# Altium project DMP_SEM_MAIN_BOARD_CONSTRAINT.PrjPcb
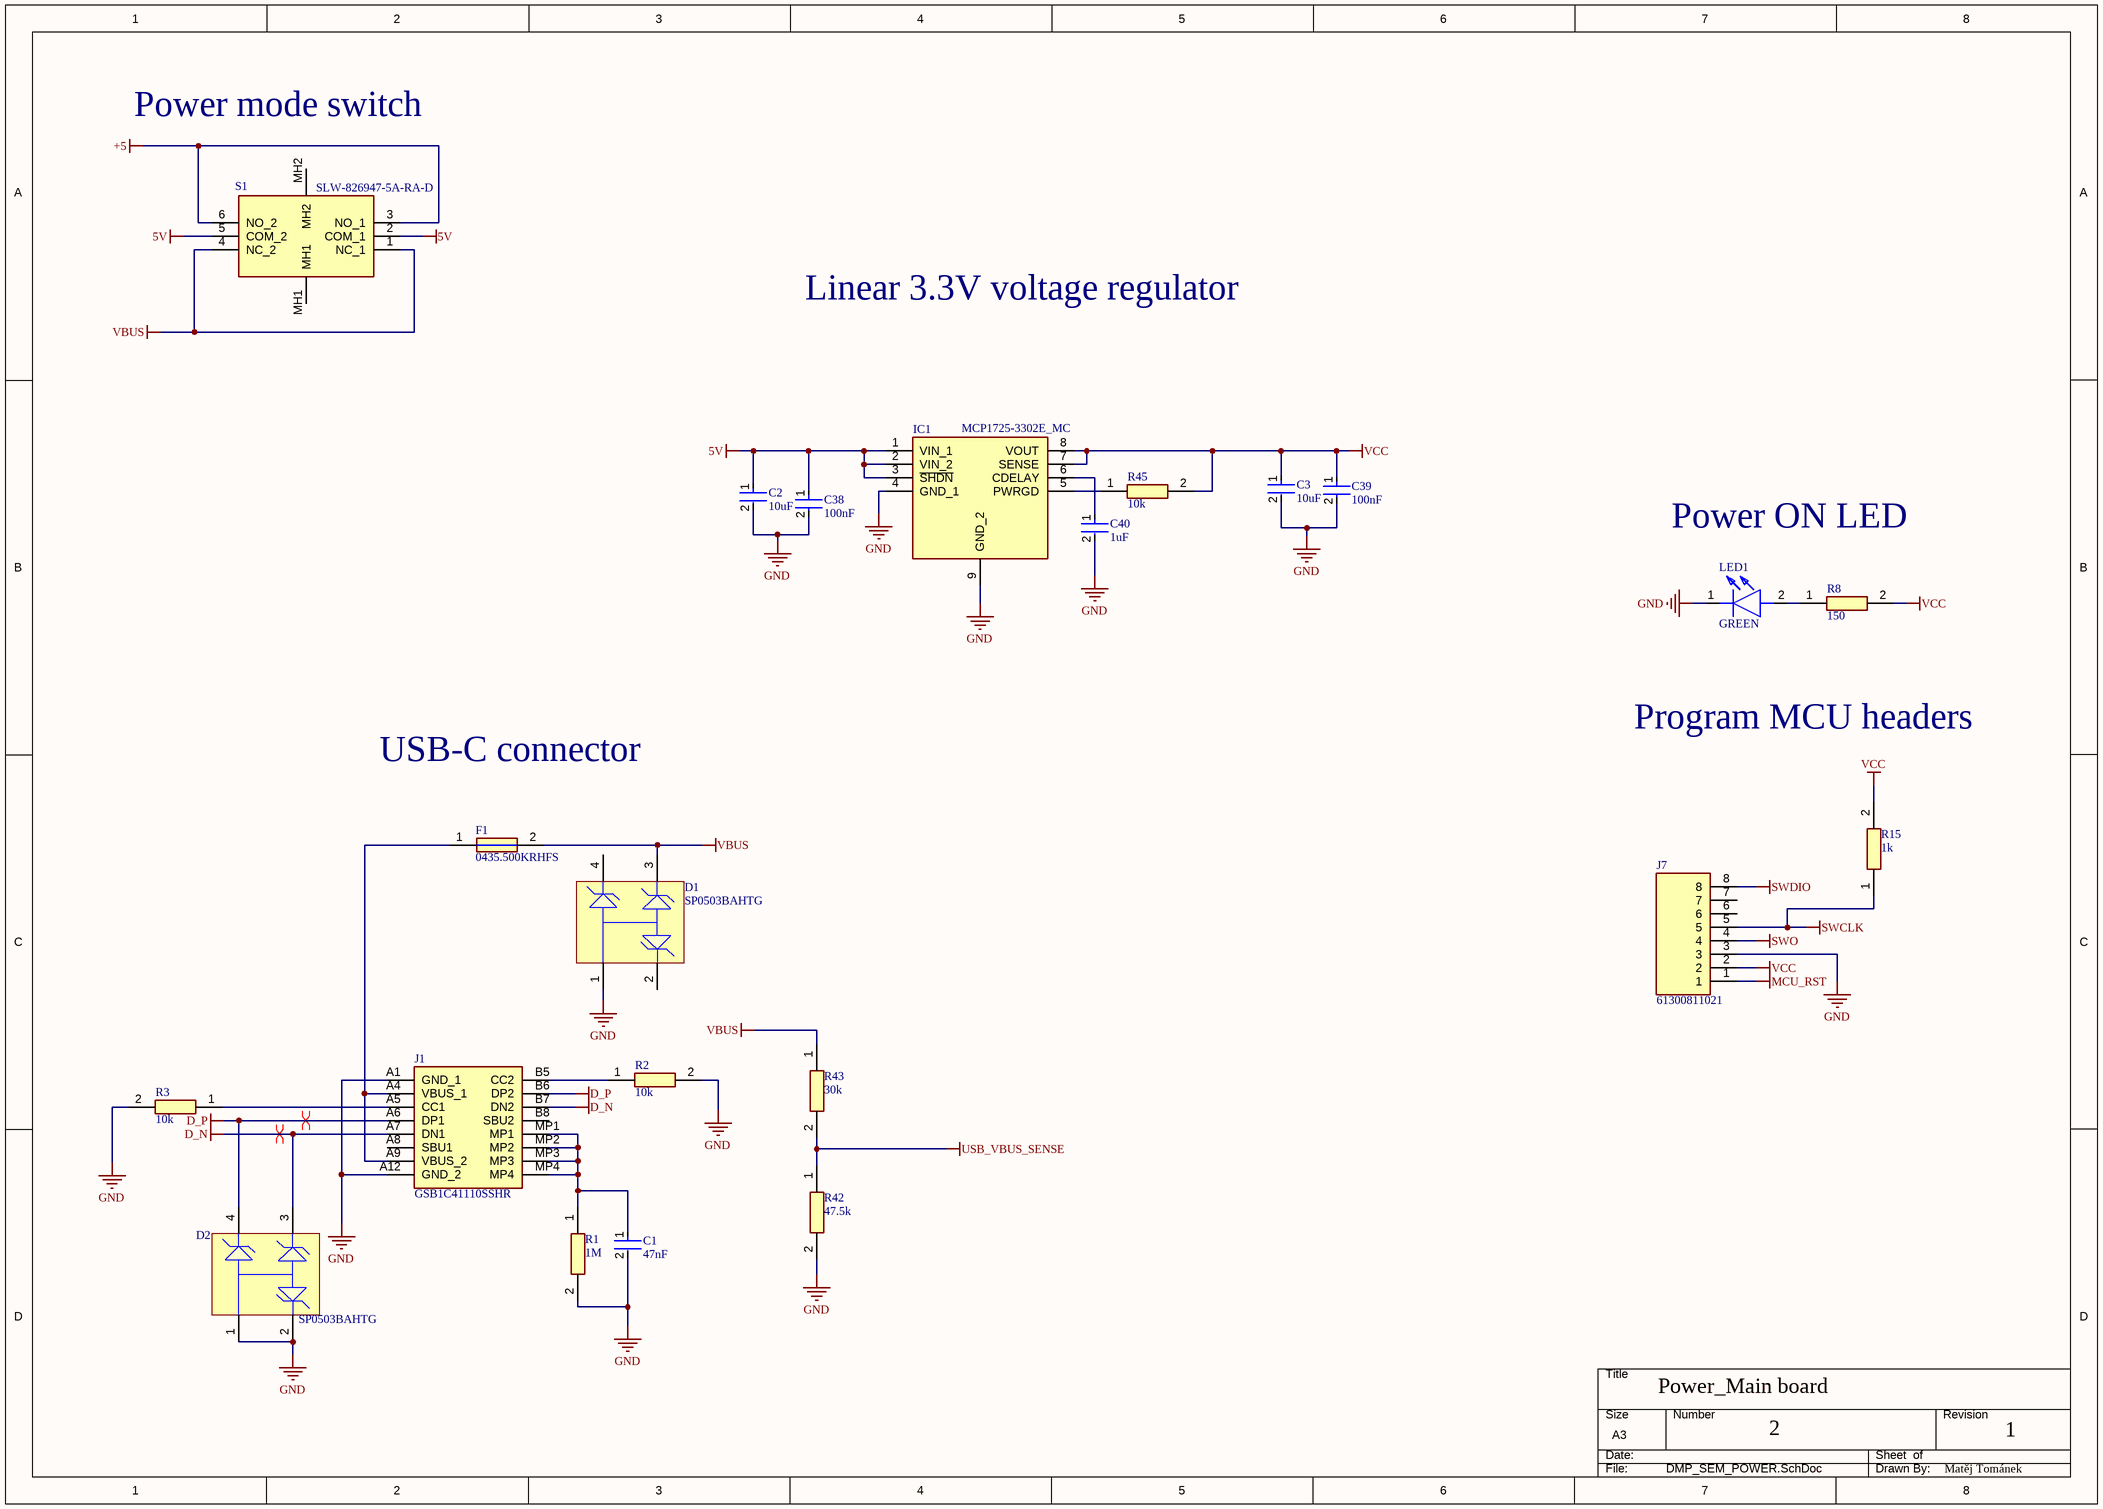
[diagram p0: DMP_SEM_POWER.SchDoc]
4 sheets, 97 parts. Net scope: global (net labels, ports and power ports of the same name join across sheets).
Board file: DMP_SEM_MAIN_PCB.PcbDoc
Sheets:
  DMP_SEM_POWER.SchDoc
  DMP_SEM_MCU.SchDoc
  DMP_SEM_ETHERNET.SchDoc
  DMP_SEM_SDCARD.SchDoc

## Sheet DMP_SEM_POWER.SchDoc: Target MCU
size A3; Organization: Microchip; Address1: Vestre Rosten 79; Address2: N-7075 TILLER; Address3: NORWAY; DocumentNumber: A09-2748; Revision: 11; SheetNumber: 1; SheetTotal: 4; DrawnBy: Microchip Norway; Engineer: HN; PageSetup: Record=PageOptions|CenterHorizontal=True|CenterVertical=True|PrintScale=1.01|XCorrection=1.00|YCorrection=1.00|PrintKind=1|BorderSize=5000000|LeftOffset=0|BottomOffset=0|Orientation=2|PaperLength=1000|PaperWidth=1000|Scale=100|PaperSource=7|PrintQuality=-4|MediaType=1|DitherType=10|PaperKind=A3 (297 x 420 mm)|PrintScaleMode=1; ProjectTitle: SAM E54 Xplained Pro; PCBNumber: A08-2643; PCBRevision: 4; ProjectName: SAM E54 Xplained Pro

### Parts
C1  47nF  [C0603X473J3RAC3316]
C2  10uF  [CL10A106KO8NQNC]
C3  10uF  [CL10A106KO8NQNC]
C38  100nF  [CL05B104KO5NNNC]
C39  100nF  [CL05B104KO5NNNC]
C40  1uF  [GRM155C81C105KE11D]
D1  SP0503BAHTG  [SP0503BAHTG]
D2  SP0503BAHTG  [SP0503BAHTG]
F1  0435.500KRHFS  [0435.500KRHFS]
IC1  MCP1725-3302E_MC  [MCP1725-3302E_MC]
J1  GSB1C41110SSHR  [GSB1C41110SSHR]
J7  61300811021  [61300811021]
LED1  GREEN  [SMLEN3EC8TT86]
R1  1M  [RC0402FR-071ML]
R2  10k  [CRCW060310K0FKEA]
R3  10k  [CRCW060310K0FKEA]
R8  150  [CRCW0402150RFKEDHP]
R15  1k  [RC0603FR-071KL]
R42  47.5k  [ERJ-PA3D4752V]
R43  30k  [RT0603DRD0730KL]
R45  10k  [CRCW060310K0FKEA]
S1  SLW-826947-5A-RA-D  [SLW-826947-5A-RA-D]

### Nets
5V: C2.1 C38.1 IC1.1(VIN_1) IC1.2(VIN_2) IC1.3(~{SHDN}) S1.2(COM_1) S1.5(COM_2)
+5: S1.3(NO_1) S1.6(NO_2)
D_N: D2.3 J1.A7(DN1) J1.B7(DN2)
D_P: D2.4 J1.A6(DP1) J1.B6(DP2)
GND: C1.2 C2.2 C3.2 C38.2 C39.2 C40.2 D1.1 D2.1 D2.2 IC1.4(GND_1) IC1.9(GND_2) J1.A1(GND_1) J1.A12(GND_2) J7.3 LED1.1(K) R1.2 R2.2 R3.2 R42.2
MCU_RST: J7.1
SWCLK: J7.5 R15.1
SWDIO: J7.8
SWO: J7.4
USB_VBUS_SENSE: R42.1 R43.2
VBUS: D1.3 F1.2 R43.1 S1.1(NC_1) S1.4(NC_2)
VCC: C3.1 C39.1 IC1.7(SENSE) IC1.8(VOUT) J7.2 R8.2 R15.2 R45.2
NetC1_1: C1.1 J1.MP1 J1.MP2 J1.MP3 J1.MP4 R1.1
NetC40_1: C40.1 IC1.6(CDELAY)
NetF1_1: F1.1 J1.A4(VBUS_1) J1.A9(VBUS_2)
NetIC1_5: IC1.5(PWRGD) R45.1
NetJ1_A5: J1.A5(CC1) R3.1
NetJ1_B5: J1.B5(CC2) R2.1
NetLED1_2: LED1.2(A) R8.1

Not connected (* = marked no-connect by the designer): D1 2 4; J1 A8(SBU1) B8(SBU2); J7 6 7; S1 MH1 MH2

### Layout directives
differential pair: D_N, D_P

### Notes on the sheet
- Power mode switch
- Linear 3.3V voltage regulator
- Power ON LED
- USB-C connector
- Program MCU headers
- Power_Main board
- 2
- 1
- Matěj Tománek
- DWG. NO.
- REV.
- SHT.
- THIS DOCUMENT AND THE DATA DISCLOSED HEREIN OR HEREWITH IS THE PROPERTY OF ALTIUM LIMITED AND MAY BE FREELY DISTRIBUTED IN WHOLE. NO RIGHTS ARE RESERVED OR EXPRESS OR IMPLIED WARANTEE GIVEN.
- REVISION
- DESCRIPTION
- DATE
- APPROVED
- ENG:
- APPROVALS
- PROJECT
- DSN:
- CHK:
- REFERENCE DOCUMENTS
- PROJECT REVISION:
- TITLE
- DOCUMENT REVISION:
- DESIGN ITEM:
- BOM:
- FAB DWG:
- PCB DWG:
- ASSY DWG:
- SCALE:
- SIZE
- B
- CAGE CODE
- FILE NAME
- DWG NO.
- SHEET
- OF
- REV

### Library data of the parts
C1 = C0603X473J3RAC3316: Capacitor C0603X473J3RAC3316
C2 C3 = CL10A106KO8NQNC: Capacitor CL10A106KO8NQNC
C38 C39 = CL05B104KO5NNNC: Capacitor CL05B104KO5NNNC
C40 = GRM155C81C105KE11D: Capacitor GRM155C81C105KE11D
D1 D2 = SP0503BAHTG: TVS Diodes SP0503BAHTG
F1 = 0435.500KRHFS: Fuse 0435.500KRHFS
IC1 = MCP1725-3302E_MC: Linear voltage regulator  MCP1725-3302E_MC
J1 = GSB1C41110SSHR: USB-C Connector
J7 = 61300811021: Programing connector 61300811021
LED1 = SMLEN3EC8TT86: GREEN LED Diode
R1 = RC0402FR-071ML: Resistor RC0402FR-071ML
R2 R3 R45 = CRCW060310K0FKEA: Resistor CRCW060310K0FKEA
R8 = CRCW0402150RFKEDHP: Resistor CRCW0402150RFKEDHP
R15 = RC0603FR-071KL: Resistor RC0603FR-071KL
R42 = ERJ-PA3D4752V: Resistor ERJ-PA3D4752V
R43 = RT0603DRD0730KL: Resistor RT0603DRD0730KL
S1 = SLW-826947-5A-RA-D: Switch SLW-826947-5A-RA-D

## Sheet DMP_SEM_MCU.SchDoc: Target MCU
size A3; Organization: Microchip; Address1: Vestre Rosten 79; Address2: N-7075 TILLER; Address3: NORWAY; DocumentNumber: A09-2748; Revision: 11; SheetNumber: 2; SheetTotal: 4; DrawnBy: Microchip Norway; Engineer: HN; PageSetup: Record=PageOptions|CenterHorizontal=True|CenterVertical=True|PrintScale=1.01|XCorrection=1.00|YCorrection=1.00|PrintKind=1|BorderSize=5000000|LeftOffset=0|BottomOffset=0|Orientation=2|PaperLength=1000|PaperWidth=1000|Scale=100|PaperSource=7|PrintQuality=-4|MediaType=1|DitherType=10|PaperKind=A3 (297 x 420 mm)|PrintScaleMode=1; ProjectTitle: SAM E54 Xplained Pro; PCBNumber: A08-2643; PCBRevision: 4; ProjectName: SAM E54 Xplained Pro
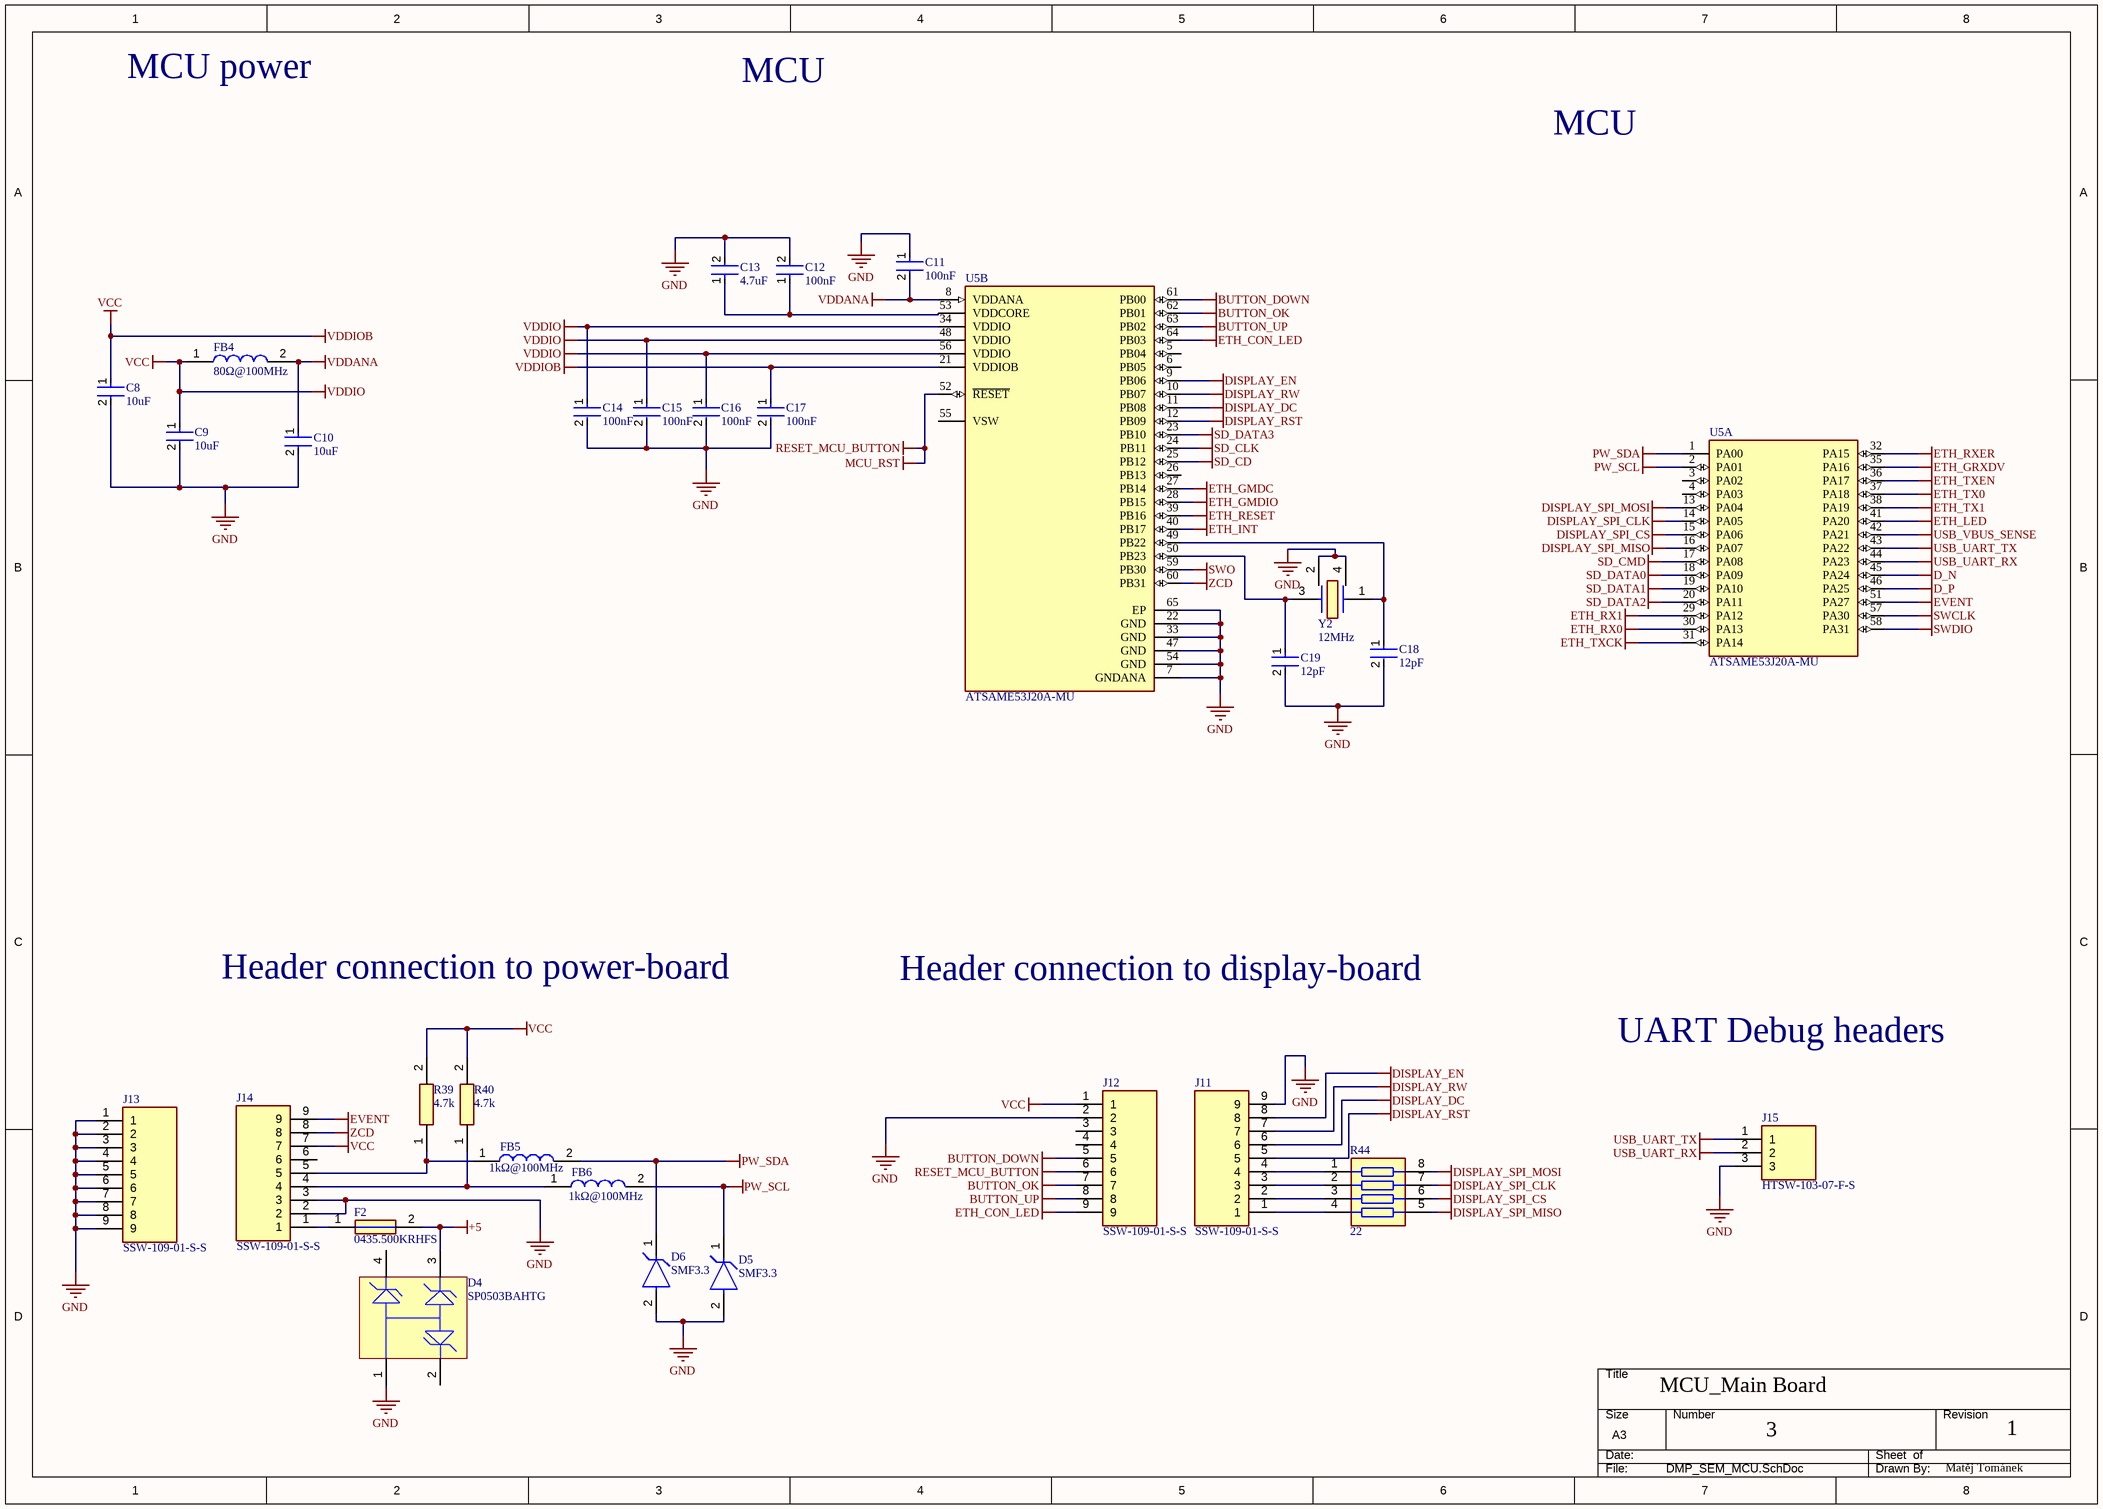
[diagram p1: DMP_SEM_MCU.SchDoc]

### Parts
C8  10uF  [CL10A106KO8NQNC]
C9  10uF  [CL10A106KO8NQNC]
C10  10uF  [CL10A106KO8NQNC]
C11  100nF  [CL05B104KO5NNNC]
C12  100nF  [CL05B104KO5NNNC]
C13  4.7uF  [CL05A475KP5NRNC]
C14  100nF  [CL05B104KO5NNNC]
C15  100nF  [CL05B104KO5NNNC]
C16  100nF  [CL05B104KO5NNNC]
C17  100nF  [CL05B104KO5NNNC]
C18  12pF  [GRM1555C1H120JA01D]
C19  12pF  [GRM1555C1H120JA01D]
D4  SP0503BAHTG  [SP0503BAHTG]
D5  SMF3.3  [SMF3.3]
D6  SMF3.3  [SMF3.3]
F2  0435.500KRHFS  [0435.500KRHFS]
FB4  80Ω@100MHz  [BLM15PD800SN1D]
FB5  1kΩ@100MHz  [BLM15BD102SN1D]
FB6  1kΩ@100MHz  [BLM15BD102SN1D]
J11  SSW-109-01-S-S  [SSW-109-01-S-S]
J12  SSW-109-01-S-S  [SSW-109-01-S-S]
J13  SSW-109-01-S-S  [SSW-109-01-S-S]
J14  SSW-109-01-S-S  [SSW-109-01-S-S]
J15  HTSW-103-07-F-S  [HTSW-103-07-F-S]
R39  4.7k  [ERJ-3EKF4701V]
R40  4.7k  [ERJ-3EKF4701V]
R44  22  [CAY10-220J4LF]
U5  ATSAME53J20A-MU  [FP-PA-IPC_A]  (parts A,B of 2)
Y2  12MHz  [ABM8W-12.0000MHZ-6-B1U-T3]

### Nets
+5: D4.3 F2.2
BUTTON_DOWN: J12.5 U5.61(PB00)
BUTTON_OK: J12.7 U5.62(PB01)
BUTTON_UP: J12.8 U5.63(PB02)
D_N: U5.45(PA24)
D_P: U5.46(PA25)
DISPLAY_DC: J11.6 U5.11(PB08)
DISPLAY_EN: J11.8 U5.9(PB06)
DISPLAY_RST: J11.5 U5.12(PB09)
DISPLAY_RW: J11.7 U5.10(PB07)
DISPLAY_SPI_CLK: R44.7 U5.14(PA05)
DISPLAY_SPI_CS: R44.6 U5.15(PA06)
DISPLAY_SPI_MISO: R44.5 U5.16(PA07)
DISPLAY_SPI_MOSI: R44.8 U5.13(PA04)
ETH_CON_LED: J12.9 U5.64(PB03)
ETH_GMDC: U5.27(PB14)
ETH_GMDIO: U5.28(PB15)
ETH_GRXDV: U5.35(PA16)
ETH_INT: U5.40(PB17)
ETH_LED: U5.41(PA20)
ETH_RESET: U5.39(PB16)
ETH_RX0: U5.30(PA13)
ETH_RX1: U5.29(PA12)
ETH_RXER: U5.32(PA15)
ETH_TX0: U5.37(PA18)
ETH_TX1: U5.38(PA19)
ETH_TXCK: U5.31(PA14)
ETH_TXEN: U5.36(PA17)
EVENT: J14.9 U5.51(PA27)
GND: C8.2 C9.2 C10.2 C11.1 C12.2 C13.2 C14.2 C15.2 C16.2 C17.2 C18.2 C19.2 D4.1 D5.2(A) D6.2(A) J11.9 J12.2 J13.1 J13.2 J13.3 J13.4 J13.5 J13.6 J13.7 J13.8 J13.9 J14.2 J14.3 J15.3 U5.7(GNDANA) U5.22(GND) U5.33(GND) U5.47(GND) U5.54(GND) U5.65(EP) Y2.2 Y2.4
MCU_RST: J12.6 U5.52(~{RESET})  [also labelled RESET_MCU_BUTTON]
PW_SCL: D5.1(C) FB6.2 U5.2(PA01)
PW_SDA: D6.1(C) FB5.2 U5.1(PA00)
SD_CD: U5.25(PB12)
SD_CLK: U5.24(PB11)
SD_CMD: U5.17(PA08)
SD_DATA0: U5.18(PA09)
SD_DATA1: U5.19(PA10)
SD_DATA2: U5.20(PA11)
SD_DATA3: U5.23(PB10)
SWCLK: U5.57(PA30)
SWDIO: U5.58(PA31)
SWO: U5.59(PB30)
USB_UART_RX: J15.2 U5.44(PA23)
USB_UART_TX: J15.1 U5.43(PA22)
USB_VBUS_SENSE: U5.42(PA21)
VCC: C8.1 C9.1 C14.1 C15.1 C16.1 C17.1 FB4.1 J12.1 J14.7 R39.2 R40.2 U5.21(VDDIOB) U5.34(VDDIO) U5.48(VDDIO) U5.56(VDDIO)  [also labelled VDDIO, VDDIOB]
VDDANA: C10.1 C11.2 FB4.2 U5.8(VDDANA)
ZCD: J14.8 U5.60(PB31)
NetC12_1: C12.1 C13.1 U5.53(VDDCORE)
NetC18_1: C18.1 U5.49(PB22) Y2.1
NetC19_1: C19.1 U5.50(PB23) Y2.3
NetF2_1: F2.1 J14.1
NetFB5_1: FB5.1 J14.5 R39.1
NetFB6_1: FB6.1 J14.4 R40.1
NetJ11_1: J11.1 R44.4
NetJ11_2: J11.2 R44.3
NetJ11_3: J11.3 R44.2
NetJ11_4: J11.4 R44.1

Not connected (* = marked no-connect by the designer): D4 2 4; J12 3 4; J14 6; U5 3(PA02) 4(PA03) 5(PB04) 6(PB05) 26(PB13) 55(VSW)

### Notes on the sheet
- MCU power
- MCU
- Header connection to power-board
- Header connection to display-board
- UART Debug headers
- MCU_Main Board
- 3
- 1
- Matěj Tománek
- DWG. NO.
- REV.
- SHT.
- THIS DOCUMENT AND THE DATA DISCLOSED HEREIN OR HEREWITH IS THE PROPERTY OF ALTIUM LIMITED AND MAY BE FREELY DISTRIBUTED IN WHOLE. NO RIGHTS ARE RESERVED OR EXPRESS OR IMPLIED WARANTEE GIVEN.
- REVISION
- DESCRIPTION
- DATE
- APPROVED
- ENG:
- APPROVALS
- PROJECT
- DSN:
- CHK:
- REFERENCE DOCUMENTS
- PROJECT REVISION:
- TITLE
- DOCUMENT REVISION:
- DESIGN ITEM:
- BOM:
- FAB DWG:
- PCB DWG:
- ASSY DWG:
- SCALE:
- SIZE
- B
- CAGE CODE
- FILE NAME
- DWG NO.
- SHEET
- OF
- REV

### Library data of the parts
C8-C10 = CL10A106KO8NQNC: Capacitor CL10A106KO8NQNC
C11 C12 C14-C17 = CL05B104KO5NNNC: Capacitor CL05B104KO5NNNC
C13 = CL05A475KP5NRNC: Capacitor CL05A475KP5NRNC
C18 C19 = GRM1555C1H120JA01D: Capacitor GRM1555C1H120JA01D
D4 = SP0503BAHTG: TVS Diodes SP0503BAHTG
D5 D6 = SMF3.3: TVS diode SMF3.3
F2 = 0435.500KRHFS: Fuse 0435.500KRHFS
FB4 = BLM15PD800SN1D: Chip Ferrite Bead BLM15PD800SN1D
FB5 FB6 = BLM15BD102SN1D: Chip Ferrite Bead BLM15BD102SN1D
J11-J14 = SSW-109-01-S-S: Connector SSW-109-01-S-S
J15 = HTSW-103-07-F-S: Headers HTSW-103-07-F-S
R39 R40 = ERJ-3EKF4701V: Resistor ERJ-3EKF4701V
R44 = CAY10-220J4LF: Resistor array CAY10-220J4LF
U5 = CMP-06276-000633-1: IC MCU 32BIT 1MB FLASH 64VQFN; Core Architecture: ARM; Frequency: 120MHz; Oscillator Type: Internal; Number of I/Os: 51; Peripherals: Brown-out Detect/Reset; Interface: I2C; Case/Package: VQFN; Packaging: Tray; Memory Type: FLASH; Min Operating Temperature: -40°C; Max Operating Temperature: 85°C; Memory Size: 1MB
Y2 = ABM8W-12.0000MHZ-6-B1U-T3: Crystal ABM8W-12.0000MHZ-6-B1U-T3

## Sheet DMP_SEM_ETHERNET.SchDoc: Target MCU
size A3; Organization: Microchip; Address1: Vestre Rosten 79; Address2: N-7075 TILLER; Address3: NORWAY; DocumentNumber: A09-2748; Revision: 11; SheetNumber: 3; SheetTotal: 4; DrawnBy: Microchip Norway; Engineer: HN; PageSetup: Record=PageOptions|CenterHorizontal=True|CenterVertical=True|PrintScale=1.01|XCorrection=1.00|YCorrection=1.00|PrintKind=1|BorderSize=5000000|LeftOffset=0|BottomOffset=0|Orientation=2|PaperLength=1000|PaperWidth=1000|Scale=100|PaperSource=7|PrintQuality=-4|MediaType=1|DitherType=10|PaperKind=A3 (297 x 420 mm)|PrintScaleMode=1; ProjectTitle: SAM E54 Xplained Pro; PCBNumber: A08-2643; PCBRevision: 4; ProjectName: SAM E54 Xplained Pro
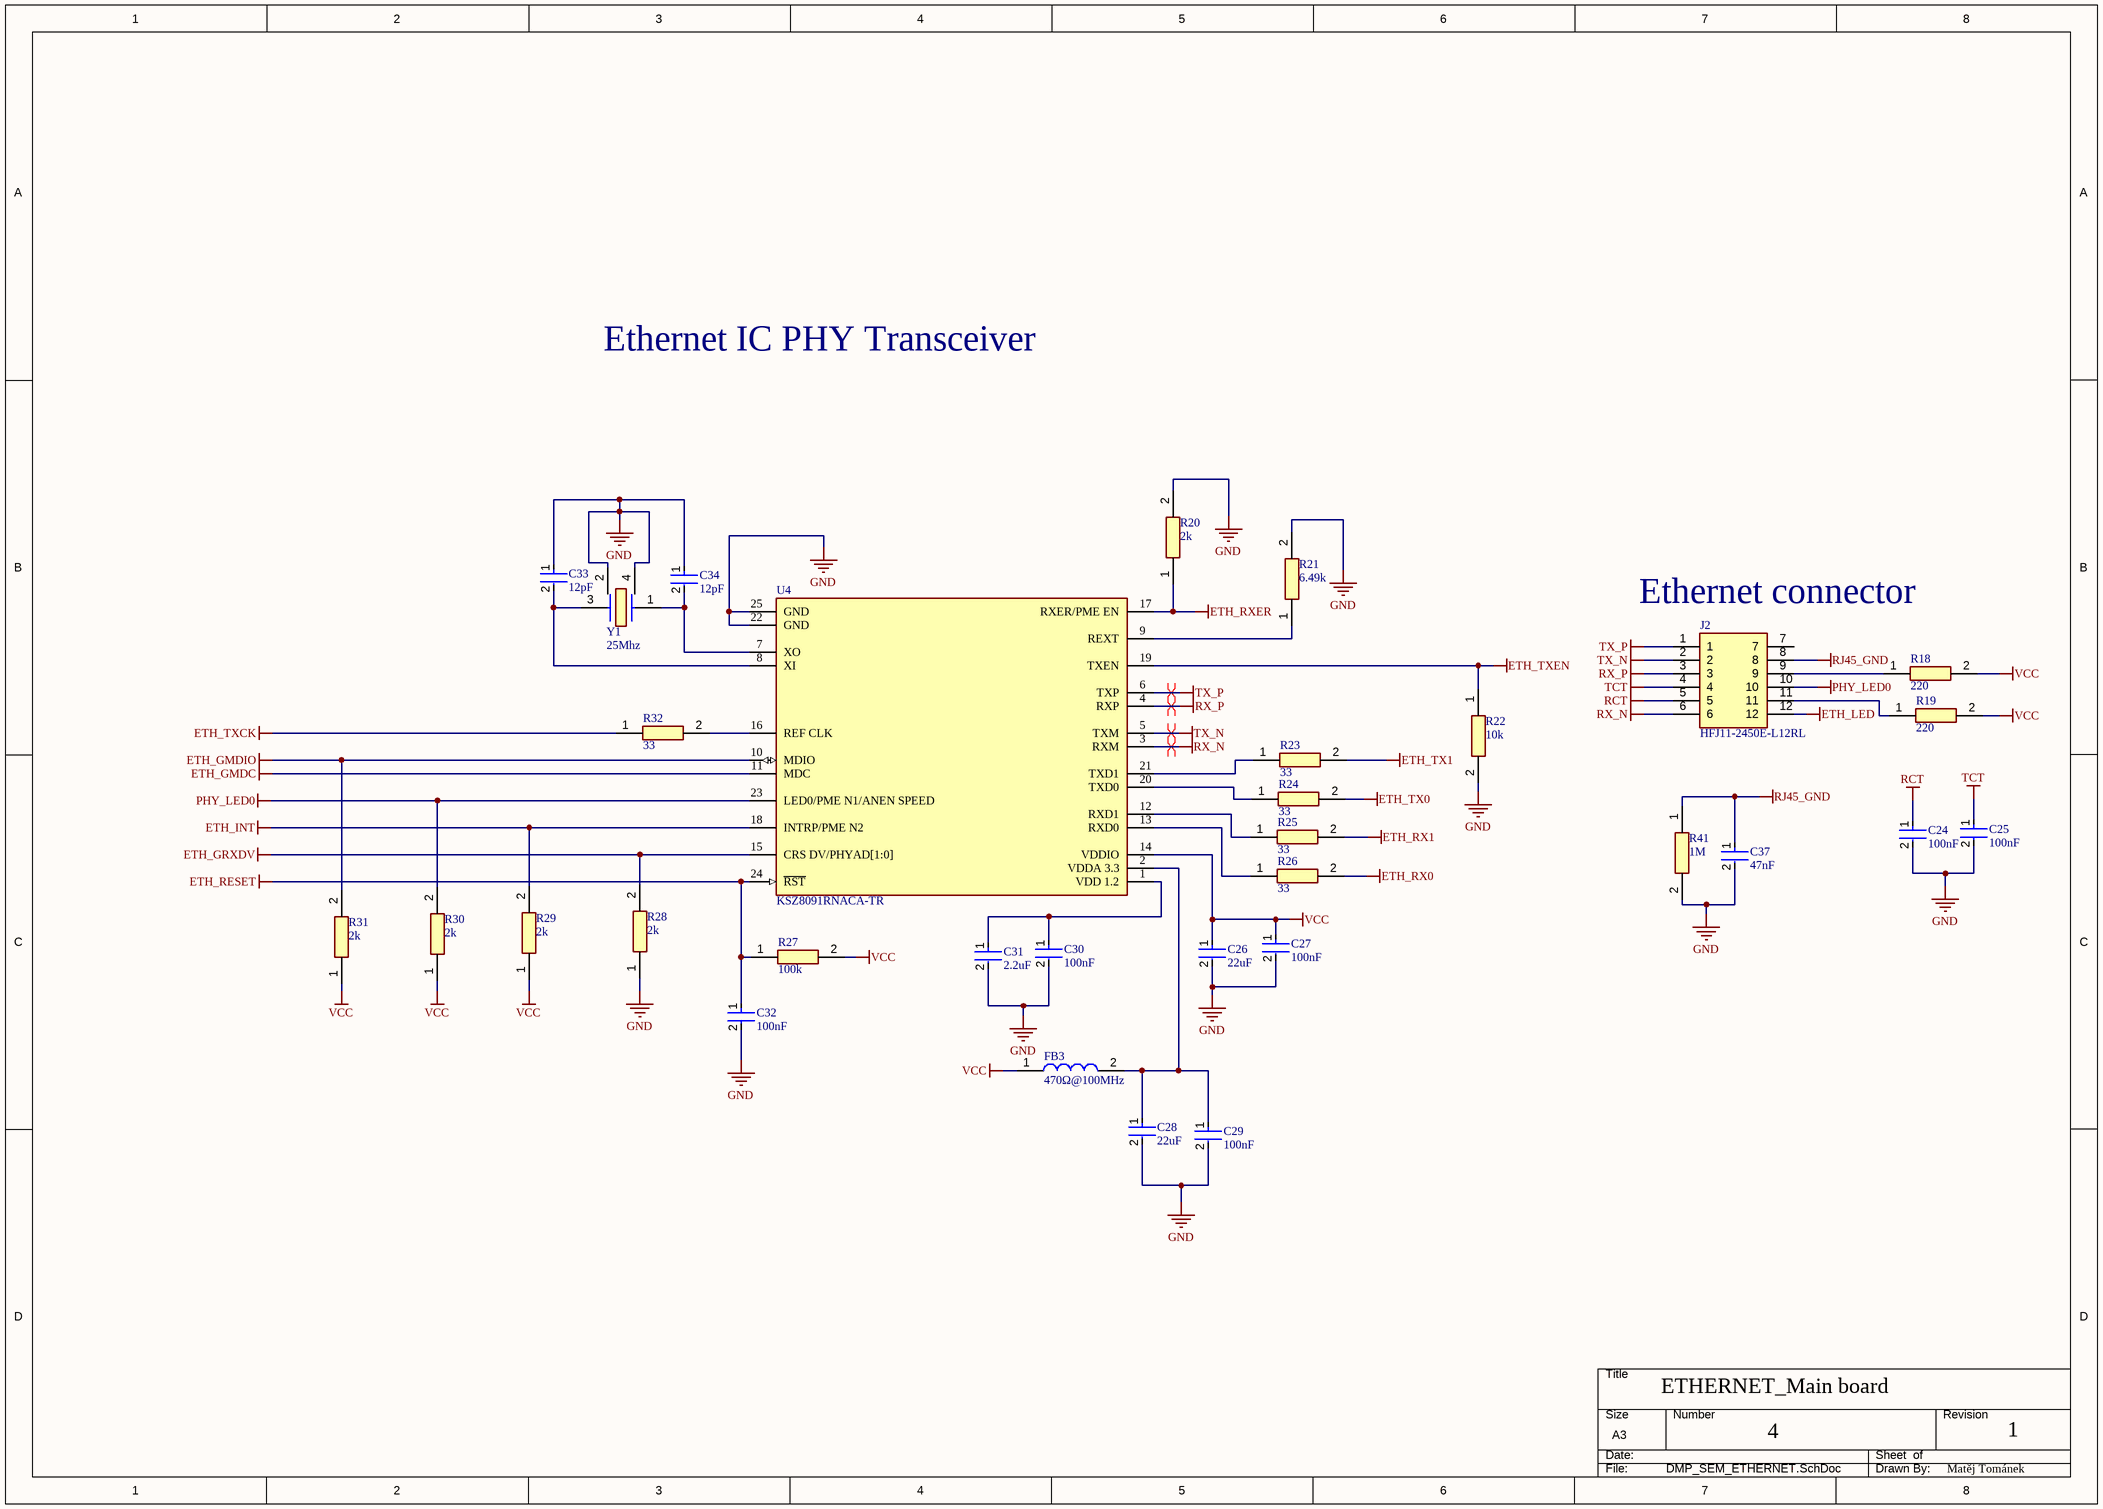
[diagram p2: DMP_SEM_ETHERNET.SchDoc]

### Parts
C24  100nF  [CL05B104KO5NNNC]
C25  100nF  [CL05B104KO5NNNC]
C26  22uF  [GRM188R61A226ME15D]
C27  100nF  [CL05B104KO5NNNC]
C28  22uF  [GRM188R61A226ME15D]
C29  100nF  [CL05B104KO5NNNC]
C30  100nF  [CL05B104KO5NNNC]
C31  2.2uF  [GRM188R61C225KAADJ]
C32  100nF  [CL05B104KO5NNNC]
C33  12pF  [C0402C120J5GACTU]
C34  12pF  [C0402C120J5GACTU]
C37  47nF  [C0603X473J3RAC3316]
FB3  470Ω@100MHz  [BLM18PG471SN1D]
J2  HFJ11-2450E-L12RL  [HFJ11-2450E-L12RL]
R18  220  [CRCW0603220RFKEC]
R19  220  [CRCW0603220RFKEC]
R20  2k  [ERA-2AEB202X]
R21  6.49k  [ERA-3AEB6491V]
R22  10k  [CRCW060310K0FKEA]
R23  33  [ERJ-U02F33R0X]
R24  33  [ERJ-U02F33R0X]
R25  33  [ERJ-U02F33R0X]
R26  33  [ERJ-U02F33R0X]
R27  100k  [ERJ-2RKF1003X]
R28  2k  [ERA-2AEB202X]
R29  2k  [ERA-2AEB202X]
R30  2k  [ERA-2AEB202X]
R31  2k  [ERA-2AEB202X]
R32  33  [ERJ-U02F33R0X]
R41  1M  [RC0402FR-071ML]
U4  KSZ8091RNACA-TR  [KSZ8091RNACA-TR]
Y1  25Mhz  [LFXTAL071758Cutt]

### Nets
ETH_GMDC: U4.11(MDC)
ETH_GMDIO: R31.2 U4.10(MDIO)
ETH_GRXDV: R28.2 U4.15(CRS_DV/PHYAD[1:0])
ETH_INT: R29.2 U4.18(INTRP/PME_N2)
ETH_LED: J2.12
ETH_RESET: C32.1 R27.1 U4.24(~{RST})
ETH_RX0: R26.2
ETH_RX1: R25.2
ETH_RXER: R20.1 U4.17(RXER/PME_EN)
ETH_TX0: R24.2
ETH_TX1: R23.2
ETH_TXCK: R32.1
ETH_TXEN: R22.1 U4.19(TXEN)
GND: C24.2 C25.2 C26.2 C27.2 C28.2 C29.2 C30.2 C31.2 C32.2 C33.1 C34.1 C37.2 R20.2 R21.2 R22.2 R28.1 R41.2 U4.22(GND) U4.25(GND) Y1.2 Y1.4
PHY_LED0: J2.10 R30.2 U4.23(LED0/PME_N1/ANEN_SPEED)
RCT: C24.1 J2.5
RJ45_GND: C37.1 J2.8 R41.1
RX_N: J2.6 U4.3(RXM)
RX_P: J2.3 U4.4(RXP)
TCT: C25.1 J2.4
TX_N: J2.2 U4.5(TXM)
TX_P: J2.1 U4.6(TXP)
VCC: C26.1 C27.1 FB3.1 R18.2 R19.2 R27.2 R29.1 R30.1 R31.1 U4.14(VDDIO)
NetC28_1: C28.1 C29.1 FB3.2 U4.2(VDDA_3.3)
NetC30_1: C30.1 C31.1 U4.1(VDD_1.2)
NetC33_2: C33.2 U4.8(XI) Y1.3
NetC34_2: C34.2 U4.7(XO) Y1.1
NetJ2_9: J2.9 R18.1
NetJ2_11: J2.11 R19.1
NetR21_1: R21.1 U4.9(REXT)
NetR23_1: R23.1 U4.21(TXD1)
NetR24_1: R24.1 U4.20(TXD0)
NetR25_1: R25.1 U4.12(RXD1)
NetR26_1: R26.1 U4.13(RXD0)
NetR32_2: R32.2 U4.16(REF_CLK)

Not connected (* = marked no-connect by the designer): J2 7

### Layout directives
differential pair: RX_N, RX_P, TX_N, TX_P

### Notes on the sheet
- Ethernet IC PHY Transceiver
- (near J2) Ethernet connector
- ETHERNET_Main board
- 4
- 1
- Matěj Tománek
- DWG. NO.
- REV.
- SHT.
- THIS DOCUMENT AND THE DATA DISCLOSED HEREIN OR HEREWITH IS THE PROPERTY OF ALTIUM LIMITED AND MAY BE FREELY DISTRIBUTED IN WHOLE. NO RIGHTS ARE RESERVED OR EXPRESS OR IMPLIED WARANTEE GIVEN.
- REVISION
- DESCRIPTION
- DATE
- APPROVED
- ENG:
- APPROVALS
- PROJECT
- DSN:
- CHK:
- REFERENCE DOCUMENTS
- PROJECT REVISION:
- TITLE
- DOCUMENT REVISION:
- DESIGN ITEM:
- BOM:
- FAB DWG:
- PCB DWG:
- ASSY DWG:
- SCALE:
- SIZE
- B
- CAGE CODE
- FILE NAME
- DWG NO.
- SHEET
- OF
- REV

### Library data of the parts
C24 C25 C27 C29 C30 C32 = CL05B104KO5NNNC: Capacitor CL05B104KO5NNNC
C26 C28 = GRM188R61A226ME15D: Capacitor GRM188R61A226ME15D
C31 = GRM188R61C225KAADJ: Capacitor GRM188R61C225KAADJ
C33 C34 = C0402C120J5GACTU: CAP CER 12PF 50V C0G/NP0 0402 C0402C120J5GACTU
C37 = C0603X473J3RAC3316: Capacitor C0603X473J3RAC3316
FB3 = BLM18PG471SN1D: Chip Ferrite Bead, 0603, 470Ω @ 100MHz, 0.2Ω, 25%, 1A BLM18PG471SN1D
J2 = HFJ11-2450E-L12RL: RJ-45 Connector
R18 R19 = CRCW0603220RFKEC: Resistor CRCW0603220RFKEC
R20 R28-R31 = ERA-2AEB202X: Resistor
R21 = ERA-3AEB6491V: Resistor ERA-3AEB6491V
R22 = CRCW060310K0FKEA: Resistor CRCW060310K0FKEA
R23-R26 R32 = ERJ-U02F33R0X: Resistor
R27 = ERJ-2RKF1003X: Resistor
R41 = RC0402FR-071ML: Resistor RC0402FR-071ML
U4 = KSZ8091RNACA-TR: IC TRANSCIEVER
Y1 = LFXTAL071758Cutt: Crystal LFXTAL071758Cutt

## Sheet DMP_SEM_SDCARD.SchDoc: Target MCU
size A3; Organization: Microchip; Address1: Vestre Rosten 79; Address2: N-7075 TILLER; Address3: NORWAY; DocumentNumber: A09-2748; Revision: 11; SheetNumber: 4; SheetTotal: 4; DrawnBy: Microchip Norway; Engineer: HN; PageSetup: Record=PageOptions|CenterHorizontal=True|CenterVertical=True|PrintScale=1.01|XCorrection=1.00|YCorrection=1.00|PrintKind=1|BorderSize=5000000|LeftOffset=0|BottomOffset=0|Orientation=2|PaperLength=1000|PaperWidth=1000|Scale=100|PaperSource=7|PrintQuality=-4|MediaType=1|DitherType=10|PaperKind=A3 (297 x 420 mm)|PrintScaleMode=1; ProjectTitle: SAM E54 Xplained Pro; PCBNumber: A08-2643; PCBRevision: 4; ProjectName: SAM E54 Xplained Pro
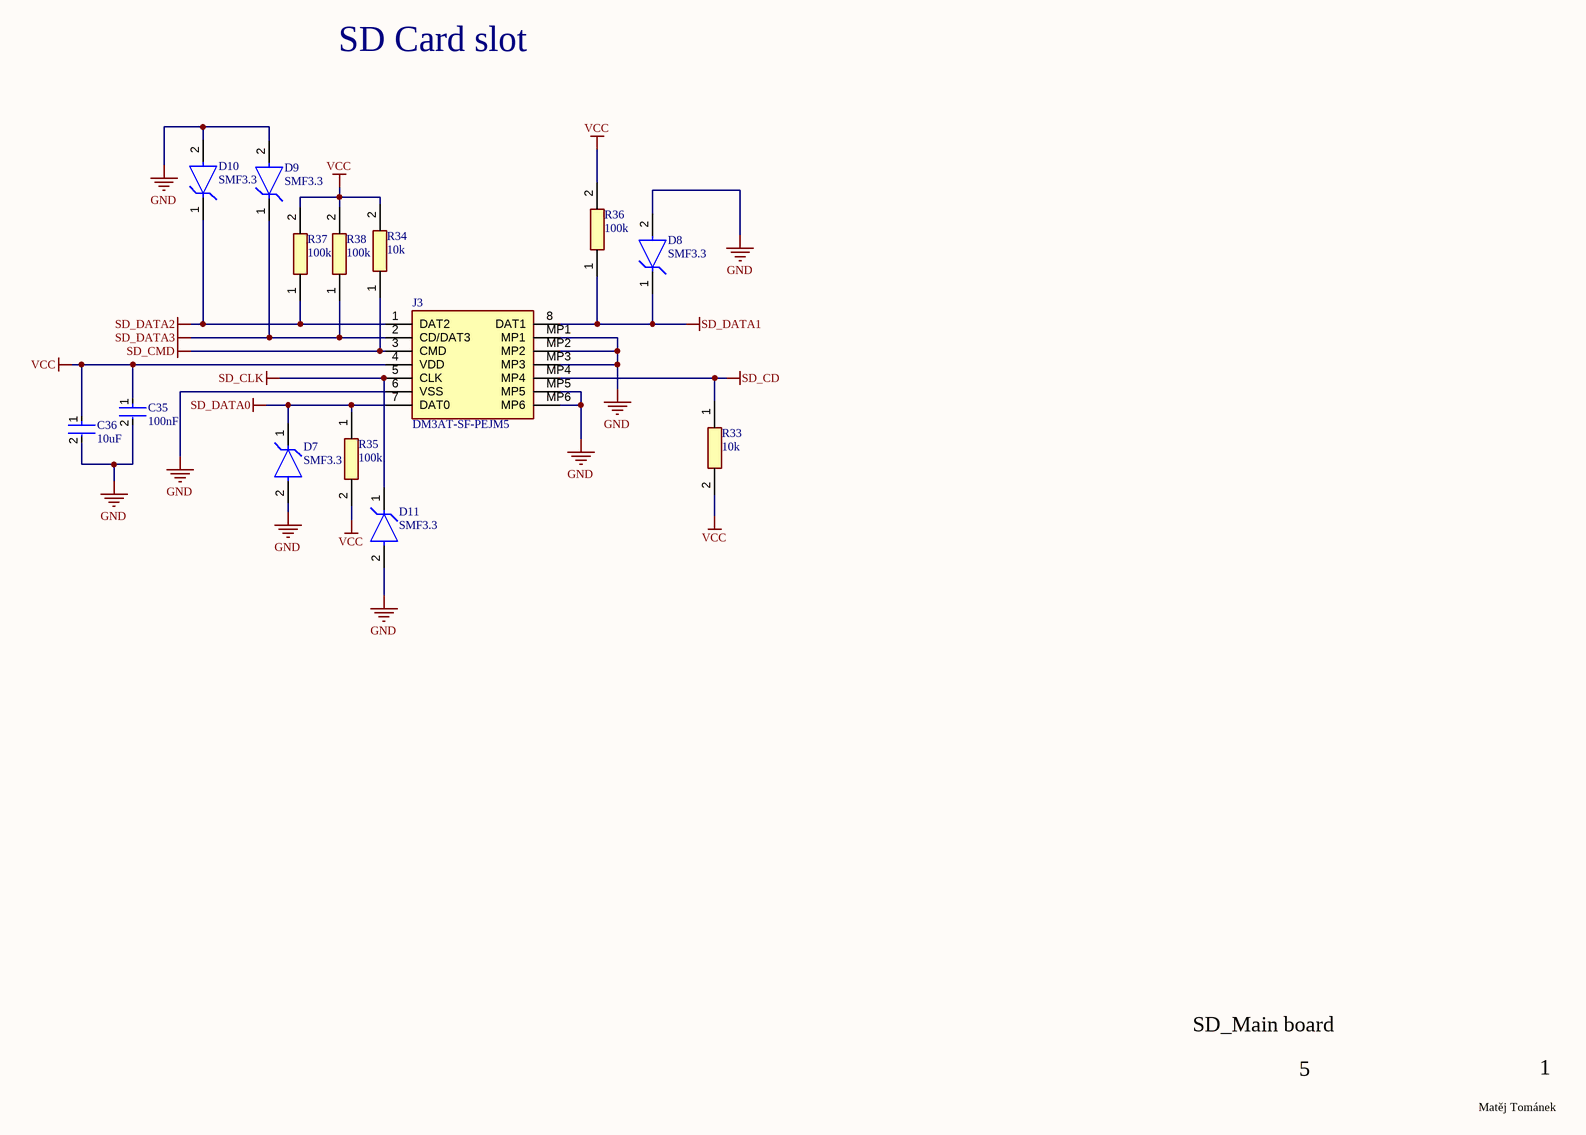
[diagram p3: DMP_SEM_SDCARD.SchDoc]

### Parts
C35  100nF  [CL05B104KO5NNNC]
C36  10uF  [CL10A106KO8NQNC]
D7  SMF3.3  [SMF3.3]
D8  SMF3.3  [SMF3.3]
D9  SMF3.3  [SMF3.3]
D10  SMF3.3  [SMF3.3]
D11  SMF3.3  [SMF3.3]
J3  DM3AT-SF-PEJM5  [DM3ATSFPEJM5]
R33  10k  [CRCW060310K0FKEA]
R34  10k  [CRCW060310K0FKEA]
R35  100k  [ERJ-2RKF1003X]
R36  100k  [ERJ-2RKF1003X]
R37  100k  [ERJ-2RKF1003X]
R38  100k  [ERJ-2RKF1003X]

### Nets
GND: C35.2 C36.2 D7.2(A) D8.2(A) D9.2(A) D10.2(A) D11.2(A) J3.6(VSS) J3.MP1 J3.MP2 J3.MP3 J3.MP5 J3.MP6
SD_CD: J3.MP4 R33.1
SD_CLK: D11.1(C) J3.5(CLK)
SD_CMD: J3.3(CMD) R34.1
SD_DATA0: D7.1(C) J3.7(DAT0) R35.1
SD_DATA1: D8.1(C) J3.8(DAT1) R36.1
SD_DATA2: D10.1(C) J3.1(DAT2) R37.1
SD_DATA3: D9.1(C) J3.2(CD/DAT3) R38.1
VCC: C35.1 C36.1 J3.4(VDD) R33.2 R34.2 R35.2 R36.2 R37.2 R38.2

### Notes on the sheet
- SD Card slot
- SD_Main board
- 5
- 1
- Matěj Tománek
- DWG. NO.
- REV.
- SHT.
- THIS DOCUMENT AND THE DATA DISCLOSED HEREIN OR HEREWITH IS THE PROPERTY OF ALTIUM LIMITED AND MAY BE FREELY DISTRIBUTED IN WHOLE. NO RIGHTS ARE RESERVED OR EXPRESS OR IMPLIED WARANTEE GIVEN.
- REVISION
- DESCRIPTION
- DATE
- APPROVED
- ENG:
- APPROVALS
- PROJECT
- DSN:
- CHK:
- REFERENCE DOCUMENTS
- PROJECT REVISION:
- TITLE
- DOCUMENT REVISION:
- DESIGN ITEM:
- BOM:
- FAB DWG:
- PCB DWG:
- ASSY DWG:
- SCALE:
- SIZE
- B
- CAGE CODE
- FILE NAME
- DWG NO.
- SHEET
- OF
- REV

### Library data of the parts
C35 = CL05B104KO5NNNC: Capacitor CL05B104KO5NNNC
C36 = CL10A106KO8NQNC: Capacitor CL10A106KO8NQNC
D7-D11 = SMF3.3: TVS diode SMF3.3
J3 = DM3AT-SF-PEJM5: Connector; Manufacturer_Name: Hirose; Datasheet Link: https://datasheet.lcsc.com/szlcsc/Hirose-HRS-DM3AT-SF-PEJM5_C114218.pdf; Height: 1.83mm; Manufacturer_Part_Number: DM3AT-SF-PEJM5; Mouser Part Number: 798-DM3AT-SF-PEJM5; Mouser Price/Stock: https://www.mouser.co.uk/ProductDetail/Hirose-Connector/DM3AT-SF-PEJM5?qs=LZSZKJVF%252B2WTDKp%252BR7IYAQ%3D%3D
R33 R34 = CRCW060310K0FKEA: Resistor CRCW060310K0FKEA
R35-R38 = ERJ-2RKF1003X: Resistor

## Nets that join several sheets
+5: DMP_SEM_POWER (S1.3 S1.6), DMP_SEM_MCU (D4.3 F2.2)
D_N: DMP_SEM_POWER (D2.3 J1.A7 J1.B7), DMP_SEM_MCU (U5.45)
D_P: DMP_SEM_POWER (D2.4 J1.A6 J1.B6), DMP_SEM_MCU (U5.46)
ETH_GMDC: DMP_SEM_MCU (U5.27), DMP_SEM_ETHERNET (U4.11)
ETH_GMDIO: DMP_SEM_MCU (U5.28), DMP_SEM_ETHERNET (R31.2 U4.10)
ETH_GRXDV: DMP_SEM_MCU (U5.35), DMP_SEM_ETHERNET (R28.2 U4.15)
ETH_INT: DMP_SEM_MCU (U5.40), DMP_SEM_ETHERNET (R29.2 U4.18)
ETH_LED: DMP_SEM_MCU (U5.41), DMP_SEM_ETHERNET (J2.12)
ETH_RESET: DMP_SEM_MCU (U5.39), DMP_SEM_ETHERNET (C32.1 R27.1 U4.24)
ETH_RX0: DMP_SEM_MCU (U5.30), DMP_SEM_ETHERNET (R26.2)
ETH_RX1: DMP_SEM_MCU (U5.29), DMP_SEM_ETHERNET (R25.2)
ETH_RXER: DMP_SEM_MCU (U5.32), DMP_SEM_ETHERNET (R20.1 U4.17)
ETH_TX0: DMP_SEM_MCU (U5.37), DMP_SEM_ETHERNET (R24.2)
ETH_TX1: DMP_SEM_MCU (U5.38), DMP_SEM_ETHERNET (R23.2)
ETH_TXCK: DMP_SEM_MCU (U5.31), DMP_SEM_ETHERNET (R32.1)
ETH_TXEN: DMP_SEM_MCU (U5.36), DMP_SEM_ETHERNET (R22.1 U4.19)
GND: DMP_SEM_POWER (19 pins), DMP_SEM_MCU (37 pins), DMP_SEM_ETHERNET (21 pins), DMP_SEM_SDCARD (13 pins)
MCU_RST: DMP_SEM_POWER (J7.1), DMP_SEM_MCU (J12.6 U5.52)
SD_CD: DMP_SEM_MCU (U5.25), DMP_SEM_SDCARD (J3.MP4 R33.1)
SD_CLK: DMP_SEM_MCU (U5.24), DMP_SEM_SDCARD (D11.1 J3.5)
SD_CMD: DMP_SEM_MCU (U5.17), DMP_SEM_SDCARD (J3.3 R34.1)
SD_DATA0: DMP_SEM_MCU (U5.18), DMP_SEM_SDCARD (D7.1 J3.7 R35.1)
SD_DATA1: DMP_SEM_MCU (U5.19), DMP_SEM_SDCARD (D8.1 J3.8 R36.1)
SD_DATA2: DMP_SEM_MCU (U5.20), DMP_SEM_SDCARD (D10.1 J3.1 R37.1)
SD_DATA3: DMP_SEM_MCU (U5.23), DMP_SEM_SDCARD (D9.1 J3.2 R38.1)
SWCLK: DMP_SEM_POWER (J7.5 R15.1), DMP_SEM_MCU (U5.57)
SWDIO: DMP_SEM_POWER (J7.8), DMP_SEM_MCU (U5.58)
SWO: DMP_SEM_POWER (J7.4), DMP_SEM_MCU (U5.59)
USB_VBUS_SENSE: DMP_SEM_POWER (R42.1 R43.2), DMP_SEM_MCU (U5.42)
VCC: DMP_SEM_POWER (8 pins), DMP_SEM_MCU (15 pins), DMP_SEM_ETHERNET (10 pins), DMP_SEM_SDCARD (9 pins)